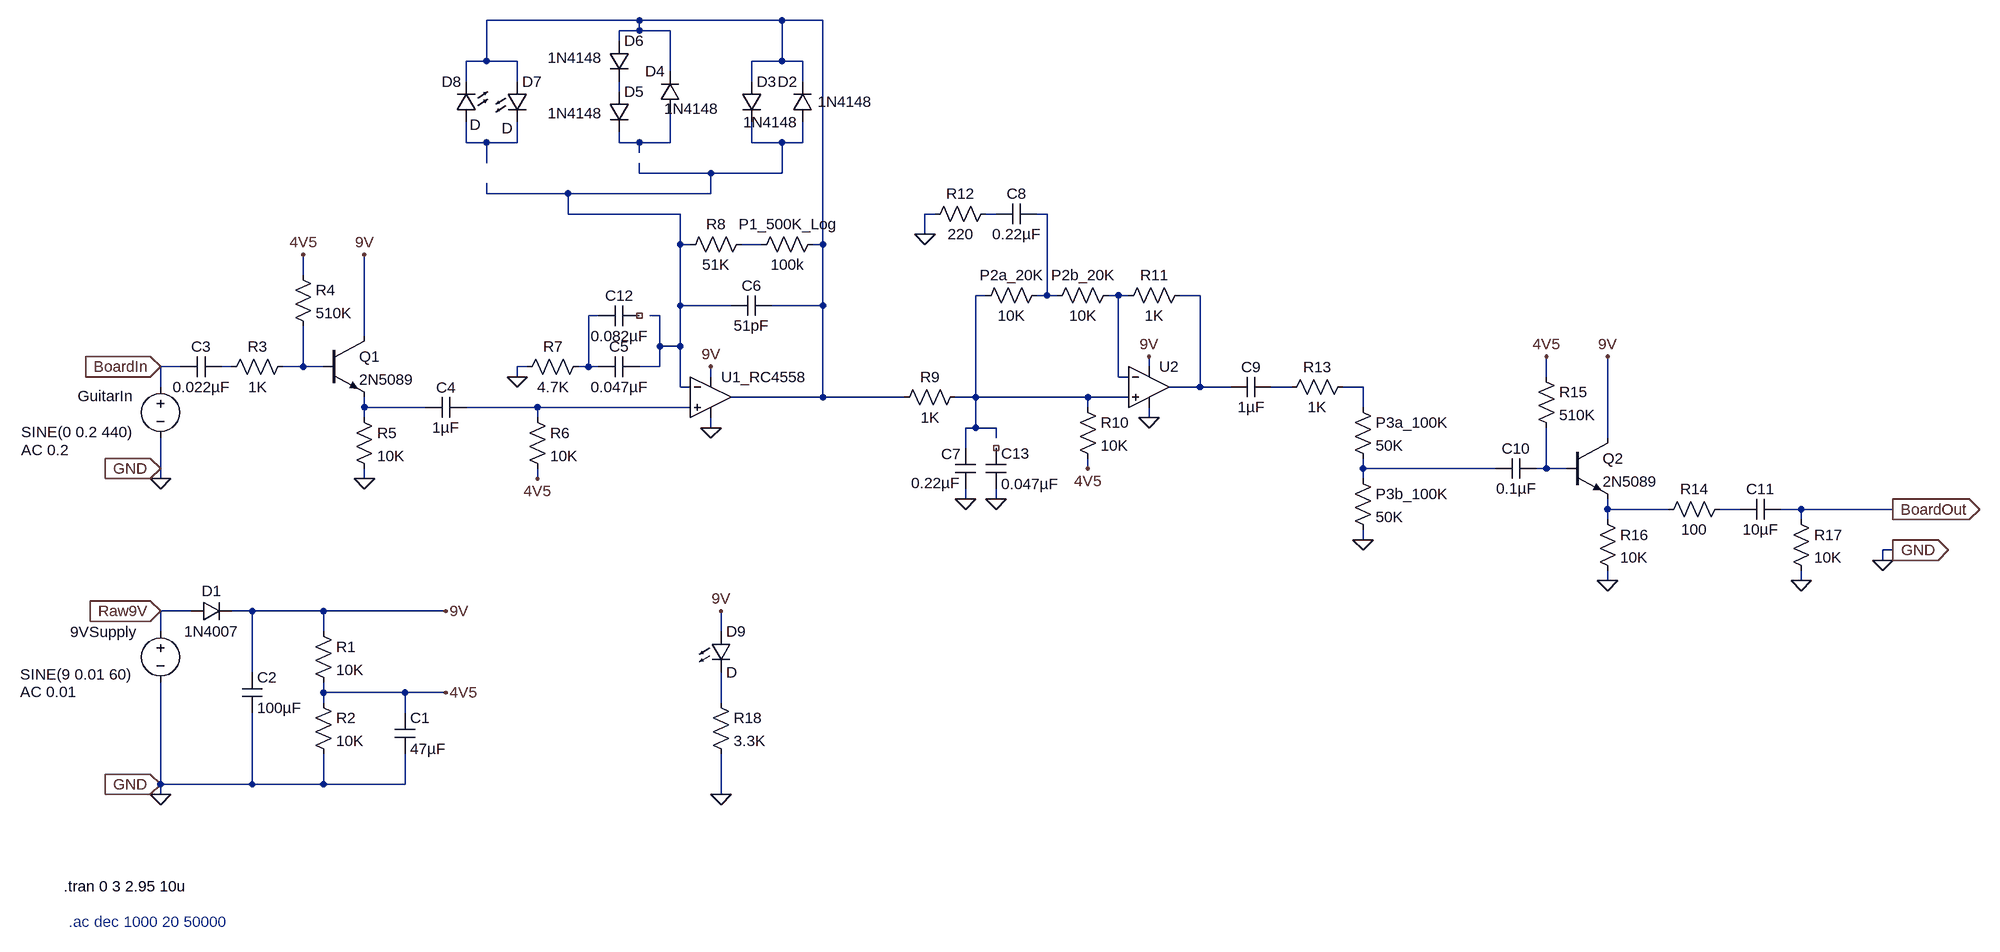
[diagram p0: schematic Modded_Tube_Screamer.asc]
Modded_Tube_Screamer.asc, the LTspice schematic file:
Version 4
SHEET 1 2800 904
WIRE 656 -528 416 -528
WIRE 880 -528 656 -528
WIRE 944 -528 880 -528
WIRE 656 -512 656 -528
WIRE 656 -512 624 -512
WIRE 704 -512 656 -512
WIRE 624 -496 624 -512
WIRE 416 -464 416 -528
WIRE 416 -464 384 -464
WIRE 464 -464 416 -464
WIRE 880 -464 880 -528
WIRE 880 -464 832 -464
WIRE 912 -464 880 -464
WIRE 704 -448 704 -512
WIRE 384 -432 384 -464
WIRE 464 -432 464 -464
WIRE 832 -432 832 -464
WIRE 912 -432 912 -464
WIRE 624 -416 624 -432
WIRE 384 -336 384 -368
WIRE 416 -336 384 -336
WIRE 464 -336 464 -368
WIRE 464 -336 416 -336
WIRE 624 -336 624 -352
WIRE 656 -336 624 -336
WIRE 704 -336 704 -384
WIRE 704 -336 656 -336
WIRE 832 -336 832 -368
WIRE 880 -336 832 -336
WIRE 912 -336 912 -368
WIRE 912 -336 880 -336
WIRE 656 -320 656 -336
WIRE 416 -304 416 -336
WIRE 656 -288 656 -304
WIRE 768 -288 656 -288
WIRE 880 -288 880 -336
WIRE 880 -288 768 -288
WIRE 416 -256 416 -272
WIRE 544 -256 416 -256
WIRE 768 -256 768 -288
WIRE 768 -256 544 -256
WIRE 544 -224 544 -256
WIRE 720 -224 544 -224
WIRE 1120 -224 1104 -224
WIRE 1216 -224 1200 -224
WIRE 1296 -224 1280 -224
WIRE 1104 -192 1104 -224
WIRE 720 -176 720 -224
WIRE 736 -176 720 -176
WIRE 848 -176 816 -176
WIRE 944 -176 944 -528
WIRE 944 -176 928 -176
WIRE 128 -128 128 -160
WIRE 1200 -96 1184 -96
WIRE 1296 -96 1296 -224
WIRE 1296 -96 1280 -96
WIRE 1312 -96 1296 -96
WIRE 1408 -96 1392 -96
WIRE 1424 -96 1408 -96
WIRE 1536 -96 1504 -96
WIRE 720 -80 720 -176
WIRE 800 -80 720 -80
WIRE 944 -80 944 -176
WIRE 944 -80 864 -80
WIRE 592 -64 576 -64
WIRE 688 -64 672 -64
WIRE 224 -32 224 -160
WIRE 688 -16 688 -64
WIRE 720 -16 720 -80
WIRE 720 -16 688 -16
WIRE -64 16 -96 16
WIRE 16 16 0 16
WIRE 128 16 128 -48
WIRE 128 16 96 16
WIRE 160 16 128 16
WIRE 480 16 464 16
WIRE 576 16 576 -64
WIRE 576 16 560 16
WIRE 592 16 576 16
WIRE 688 16 688 -16
WIRE 688 16 656 16
WIRE 1456 16 1456 0
WIRE 464 32 464 16
WIRE 768 32 768 16
WIRE 1408 32 1408 -96
WIRE 1424 32 1408 32
WIRE 2080 32 2080 0
WIRE -96 48 -96 16
WIRE 720 48 720 -16
WIRE 736 48 720 48
WIRE 1536 48 1536 -96
WIRE 1536 48 1488 48
WIRE 1584 48 1536 48
WIRE 1680 48 1648 48
WIRE 1792 48 1760 48
WIRE 944 64 944 -80
WIRE 944 64 800 64
WIRE 1072 64 944 64
WIRE 1184 64 1184 -96
WIRE 1184 64 1152 64
WIRE 1360 64 1184 64
WIRE 1424 64 1360 64
WIRE 224 80 224 64
WIRE 320 80 224 80
WIRE 496 80 384 80
WIRE 736 80 496 80
WIRE 1360 80 1360 64
WIRE 1792 80 1792 48
WIRE 224 96 224 80
WIRE 496 96 496 80
WIRE 1456 96 1456 80
WIRE 768 112 768 96
WIRE 1184 112 1184 64
WIRE 1184 112 1168 112
WIRE 1216 112 1184 112
WIRE 1216 128 1216 112
WIRE 2176 128 2176 0
WIRE 1168 144 1168 112
WIRE -96 176 -96 128
WIRE 1360 176 1360 160
WIRE 1792 176 1792 160
WIRE 2000 176 1792 176
WIRE 2080 176 2080 112
WIRE 2080 176 2064 176
WIRE 2112 176 2080 176
WIRE -96 192 -96 176
WIRE 224 192 224 176
WIRE 496 192 496 176
WIRE 1792 192 1792 176
WIRE 1168 224 1168 208
WIRE 1216 224 1216 208
WIRE 2176 240 2176 224
WIRE 2272 240 2176 240
WIRE 2384 240 2352 240
WIRE 2480 240 2448 240
WIRE 2624 240 2480 240
WIRE 2176 256 2176 240
WIRE 2480 256 2480 240
WIRE 1792 288 1792 272
WIRE 2624 304 2608 304
WIRE 2608 320 2608 304
WIRE 2176 352 2176 336
WIRE 2480 352 2480 336
WIRE -48 400 -96 400
WIRE 48 400 16 400
WIRE 160 400 48 400
WIRE 352 400 160 400
WIRE -96 432 -96 400
WIRE 160 432 160 400
WIRE 784 432 784 400
WIRE 48 496 48 400
WIRE 160 528 160 512
WIRE 288 528 160 528
WIRE 352 528 288 528
WIRE 160 544 160 528
WIRE 784 544 784 496
WIRE 288 560 288 528
WIRE -96 672 -96 512
WIRE 48 672 48 560
WIRE 48 672 -96 672
WIRE 160 672 160 624
WIRE 160 672 48 672
WIRE 288 672 288 624
WIRE 288 672 160 672
WIRE -96 688 -96 672
WIRE 784 688 784 624
FLAG -96 688 0
FLAG 352 400 9V
FLAG 352 528 4V5
FLAG 128 -160 4V5
FLAG 224 -160 9V
FLAG 224 192 0
FLAG 496 192 4V5
FLAG 768 112 0
FLAG 768 16 9V
FLAG 464 32 0
FLAG 1168 224 0
FLAG 1360 176 4V5
FLAG 1456 96 0
FLAG 1456 0 9V
FLAG 1104 -192 0
FLAG 1792 288 0
FLAG 2080 0 4V5
FLAG 2176 0 9V
FLAG 2176 352 0
FLAG 2480 352 0
FLAG 2624 240 BoardOut
IOPIN 2624 240 Out
FLAG 2608 320 0
FLAG 2624 304 GND
IOPIN 2624 304 Out
FLAG -96 192 0
FLAG -96 176 GND
IOPIN -96 176 In
FLAG -96 16 BoardIn
IOPIN -96 16 In
FLAG -96 672 GND
IOPIN -96 672 In
FLAG -96 400 Raw9V
IOPIN -96 400 In
FLAG 1216 224 0
FLAG 784 688 0
FLAG 784 400 9V
SYMBOL voltage -96 32 R0
WINDOW 0 -130 30 Left 2
WINDOW 3 -219 87 Left 2
WINDOW 123 -219 115 Left 2
WINDOW 39 0 0 Left 0
SYMATTR InstName GuitarIn
SYMATTR Value SINE(0 0.2 440)
SYMATTR Value2 AC 0.2
SYMBOL cap 0 0 R90
WINDOW 0 0 32 VBottom 2
WINDOW 3 32 32 VTop 2
SYMATTR InstName C3
SYMATTR Value 0.022µF
SYMBOL res 112 0 R90
WINDOW 0 0 56 VBottom 2
WINDOW 3 32 56 VTop 2
SYMATTR InstName R3
SYMATTR Value 1K
SYMBOL npn 160 -32 R0
SYMATTR InstName Q1
SYMATTR Value 2N5089
SYMBOL voltage -96 416 R0
WINDOW 0 -142 17 Left 2
WINDOW 3 -220 83 Left 2
WINDOW 123 -220 111 Left 2
WINDOW 39 0 0 Left 0
SYMATTR InstName 9VSupply
SYMATTR Value SINE(9 0.01 60)
SYMATTR Value2 AC 0.01
SYMBOL res 144 416 R0
SYMATTR InstName R1
SYMATTR Value 10K
SYMBOL res 144 528 R0
SYMATTR InstName R2
SYMATTR Value 10K
SYMBOL cap 272 560 R0
SYMATTR InstName C1
SYMATTR Value 47µF
SYMBOL cap 32 496 R0
SYMATTR InstName C2
SYMATTR Value 100µF
SYMBOL diode -48 416 R270
WINDOW 0 32 32 VTop 2
WINDOW 3 0 32 VBottom 2
SYMATTR InstName D1
SYMATTR Value 1N4007
SYMBOL res 112 -144 R0
SYMATTR InstName R4
SYMATTR Value 510K
SYMBOL res 208 80 R0
SYMATTR InstName R5
SYMATTR Value 10K
SYMBOL cap 384 64 R90
WINDOW 0 0 32 VBottom 2
WINDOW 3 32 32 VTop 2
SYMATTR InstName C4
SYMATTR Value 1µF
SYMBOL res 480 80 R0
SYMATTR InstName R6
SYMATTR Value 10K
SYMBOL cap 656 0 R90
WINDOW 0 0 32 VBottom 2
WINDOW 3 32 32 VTop 2
SYMATTR InstName C5
SYMATTR Value 0.047µF
SYMBOL res 576 0 R90
WINDOW 0 0 56 VBottom 2
WINDOW 3 32 56 VTop 2
SYMATTR InstName R7
SYMATTR Value 4.7K
SYMBOL cap 864 -96 R90
WINDOW 0 0 32 VBottom 2
WINDOW 3 32 32 VTop 2
SYMATTR InstName C6
SYMATTR Value 51pF
SYMBOL diode 928 -368 R180
WINDOW 0 24 64 Left 2
WINDOW 3 24 0 Left 2
SYMATTR InstName D2
SYMATTR Value 1N4148
SYMBOL diode 816 -432 R0
WINDOW 3 120 32 Left 2
SYMATTR Value 1N4148
SYMATTR InstName D3
SYMBOL res 832 -192 R90
WINDOW 0 0 56 VBottom 2
WINDOW 3 32 56 VTop 2
SYMATTR InstName R8
SYMATTR Value 51K
SYMBOL res 944 -192 R90
WINDOW 0 0 56 VBottom 2
WINDOW 3 32 56 VTop 2
SYMATTR InstName P1_500K_Log
SYMATTR Value 100k
SYMBOL res 1168 48 R90
WINDOW 0 0 56 VBottom 2
WINDOW 3 32 56 VTop 2
SYMATTR InstName R9
SYMATTR Value 1K
SYMBOL cap 1152 144 R0
WINDOW 0 -22 9 Left 2
WINDOW 3 -69 55 Left 2
SYMATTR InstName C7
SYMATTR Value 0.22µF
SYMBOL res 1344 64 R0
SYMATTR InstName R10
SYMATTR Value 10K
SYMBOL res 1520 -112 R90
WINDOW 0 0 56 VBottom 2
WINDOW 3 32 56 VTop 2
SYMATTR InstName R11
SYMATTR Value 1K
SYMBOL res 1408 -112 R90
WINDOW 0 0 56 VBottom 2
WINDOW 3 32 56 VTop 2
SYMATTR InstName P2b_20K
SYMATTR Value 10K
SYMBOL res 1296 -112 R90
WINDOW 0 0 56 VBottom 2
WINDOW 3 32 56 VTop 2
SYMATTR InstName P2a_20K
SYMATTR Value 10K
SYMBOL cap 1280 -240 R90
WINDOW 0 0 32 VBottom 2
WINDOW 3 32 32 VTop 2
SYMATTR InstName C8
SYMATTR Value 0.22µF
SYMBOL res 1216 -240 R90
WINDOW 0 0 56 VBottom 2
WINDOW 3 32 56 VTop 2
SYMATTR InstName R12
SYMATTR Value 220
SYMBOL cap 1648 32 R90
WINDOW 0 0 32 VBottom 2
WINDOW 3 32 32 VTop 2
SYMATTR InstName C9
SYMATTR Value 1µF
SYMBOL res 1776 32 R90
WINDOW 0 0 56 VBottom 2
WINDOW 3 32 56 VTop 2
SYMATTR InstName R13
SYMATTR Value 1K
SYMBOL res 1776 64 R0
SYMATTR InstName P3a_100K
SYMATTR Value 50K
SYMBOL res 1776 176 R0
SYMATTR InstName P3b_100K
SYMATTR Value 50K
SYMBOL cap 2064 160 R90
WINDOW 0 0 32 VBottom 2
WINDOW 3 32 32 VTop 2
SYMATTR InstName C10
SYMATTR Value 0.1µF
SYMBOL npn 2112 128 R0
SYMATTR InstName Q2
SYMATTR Value 2N5089
SYMBOL res 2064 16 R0
SYMATTR InstName R15
SYMATTR Value 510K
SYMBOL res 2160 240 R0
SYMATTR InstName R16
SYMATTR Value 10K
SYMBOL cap 2448 224 R90
WINDOW 0 0 32 VBottom 2
WINDOW 3 32 32 VTop 2
SYMATTR InstName C11
SYMATTR Value 10µF
SYMBOL res 2368 224 R90
WINDOW 0 0 56 VBottom 2
WINDOW 3 32 56 VTop 2
SYMATTR InstName R14
SYMATTR Value 100
SYMBOL res 2464 240 R0
SYMATTR InstName R17
SYMATTR Value 10K
SYMBOL OpAmps\\UniversalOpAmp2 768 64 R0
SYMATTR InstName U1_RC4558
SYMBOL OpAmps\\UniversalOpAmp2 1456 48 R0
SYMATTR InstName U2
SYMBOL cap 656 -80 R90
WINDOW 0 0 32 VBottom 2
WINDOW 3 32 32 VTop 2
SYMATTR InstName C12
SYMATTR Value 0.082µF
SYMBOL cap 1200 144 R0
SYMATTR InstName C13
SYMATTR Value 0.047µF
SYMBOL diode 720 -384 R180
WINDOW 0 24 64 Left 2
WINDOW 3 -60 5 Left 2
SYMATTR InstName D4
SYMATTR Value 1N4148
SYMBOL diode 608 -416 R0
WINDOW 3 -96 34 Left 2
SYMATTR Value 1N4148
SYMATTR InstName D5
SYMBOL diode 608 -496 R0
WINDOW 3 -96 27 Left 2
SYMATTR Value 1N4148
SYMATTR InstName D6
SYMBOL LED 448 -432 R0
WINDOW 3 -8 73 Left 2
SYMATTR InstName D7
SYMBOL LED 400 -368 R180
WINDOW 0 24 64 Left 2
WINDOW 3 -7 -4 Left 2
SYMATTR InstName D8
SYMBOL LED 768 432 R0
SYMATTR InstName D9
SYMBOL res 768 528 R0
SYMATTR InstName R18
SYMATTR Value 3.3K
TEXT -248 832 Left 2 !.tran 0 3 2.95 10u
TEXT -240 888 Left 2 ;.ac dec 1000 20 50000

The netlist it stands for:
* Modded_Tube_Screamer.asc
V§GuitarIn BoardIn 0 SINE(0 0.2 440) AC 0.2
C3 N013 BoardIn 0.022µF
R3 N014 N013 1K
Q1 9V N014 N017 0 2N5089
V§9VSupply Raw9V 0 SINE(9 0.01 60) AC 0.01
R1 9V 4V5 10K
R2 4V5 0 10K
C1 4V5 0 47µF
C2 9V 0 100µF
D1 Raw9V 9V 1N4007
R4 4V5 N014 510K
R5 N017 0 10K
C4 N018 N017 1µF
R6 N018 4V5 10K
C5 N005 N012 0.047µF
R7 N012 0 4.7K
C6 N001 N005 51pF
D2 N005 N001 1N4148
D3 N001 N005 1N4148
R8 N008 N005 51K
R§P1_500K_Log N001 N008 100k
R9 N009 N001 1K
C7 N009 0 0.22µF
R10 N009 4V5 10K
R11 N011 N010 1K
R§P2b_20K N010 N007 10K
R§P2a_20K N007 N009 10K
C8 N007 N006 0.22µF
R12 N006 0 220
C9 N015 N011 1µF
R13 N016 N015 1K
R§P3a_100K N016 N019 50K
R§P3b_100K N019 0 50K
C10 N020 N019 0.1µF
Q2 9V N020 N021 0 2N5089
R15 4V5 N020 510K
R16 N021 0 10K
C11 BoardOut N022 10µF
R14 N022 N021 100
R17 BoardOut 0 10K
XU1_RC4558 N018 N005 9V 0 N001 level2 Avol=1Meg GBW=10Meg Slew=10Meg Ilimit=25m Rail=0 Vos=0 En=0 Enk=0 In=0 Ink=0 Rin=500Meg  ; pins In+ In- V+ V- OUT
XU2 N009 N010 9V 0 N011 level2 Avol=1Meg GBW=10Meg Slew=10Meg Ilimit=25m Rail=0 Vos=0 En=0 Enk=0 In=0 Ink=0 Rin=500Meg  ; pins In+ In- V+ V- OUT
C12 NC_01 N012 0.082µF
C13 NC_02 0 0.047µF
D4 N004 N001 1N4148
D5 N002 N004 1N4148
D6 N001 N002 1N4148
D7 N001 N003 D
D8 N003 N001 D
D9 9V N023 D
R18 N023 0 3.3K
.model D D
.lib standard.dio
.model NPN NPN
.model PNP PNP
.lib standard.bjt
.tran 0 3 2.95 10u
* .ac dec 1000 20 50000
.lib UniversalOpAmp2.lib
.backanno
.end